# Altium schematic sheet Display-ST0103A2W-WSNLW-F.SchDoc
size B; SheetNumber: 14; SheetTotal: 15
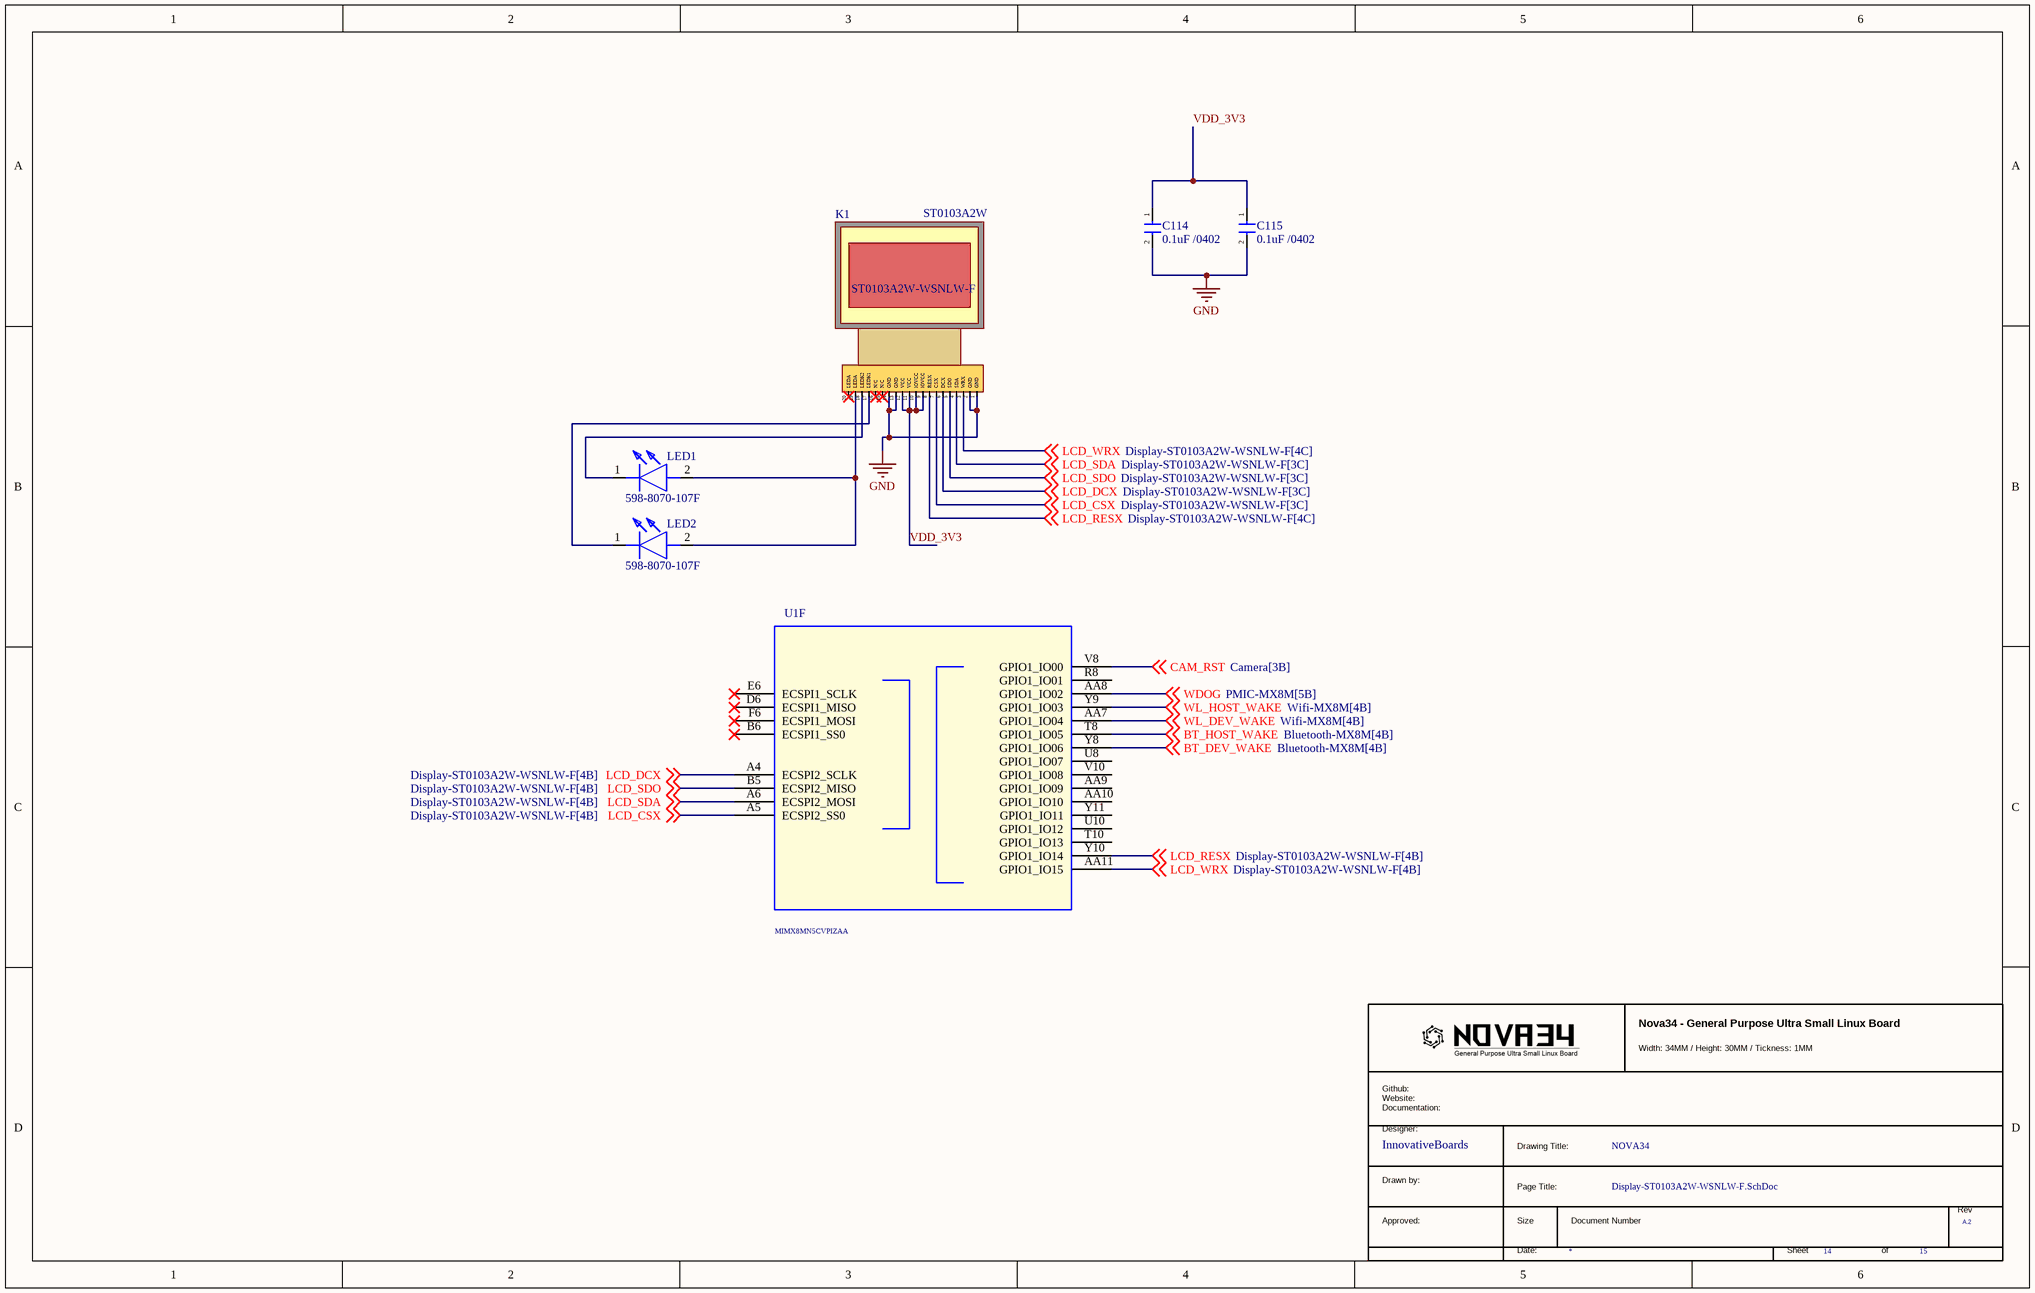
[diagram p0: Display-ST0103A2W-WSNLW-F.SchDoc]

## Parts
*  RevCode: A.2  (hidden comment: TitleBlock_MCPG)  (graphical)
C114  0.1uF /0402  [CAPC1005X70N]
C115  0.1uF /0402  [CAPC1005X70N]
K1  ST0103A2W  [Display]
LED1  598-8070-107F  [5988070107F]
LED2  598-8070-107F  [5988070107F]
U1  MIMX8MN5CVPIZAA  [BGA306C50P21X21_1100X1100X101]  (part F of 12)

## Nets
GND: C114.2 C115.2 K1.1(GND) K1.2(GND) K1.13(GND) K1.14(GND)
BT_DEV_WAKE: U1.Y8(GPIO1_IO06) ; off-sheet BT_DEV_WAKE
BT_HOST_WAKE: U1.T8(GPIO1_IO05) ; off-sheet BT_HOST_WAKE
CAM_RST: U1.V8(GPIO1_IO00) ; off-sheet CAM_RST
LCD_CSX: K1.7(CSX) U1.A5(ECSPI2_SS0) ; off-sheet LCD_CSX
LCD_DCX: K1.6(DCX) U1.A4(ECSPI2_SCLK) ; off-sheet LCD_DCX
LCD_RESX: K1.8(RESX) U1.Y10(GPIO1_IO14) ; off-sheet LCD_RESX
LCD_SDA: K1.4(SDA) U1.A6(ECSPI2_MOSI) ; off-sheet LCD_SDA
LCD_SDO: K1.5(SDO) U1.B5(ECSPI2_MISO) ; off-sheet LCD_SDO
LCD_WRX: K1.3(WRX) U1.AA11(GPIO1_IO15) ; off-sheet LCD_WRX
VDD_3V3: C114.1 C115.1 K1.9(lOVCC) K1.10(lOVCC) K1.11(VCC) K1.12(VCC)
WDOG: U1.AA8(GPIO1_IO02) ; off-sheet WDOG
WL_DEV_WAKE: U1.AA7(GPIO1_IO04) ; off-sheet WL_DEV_WAKE
WL_HOST_WAKE: U1.Y9(GPIO1_IO03) ; off-sheet WL_HOST_WAKE
NetK1_17: K1.17(LEDK1) LED2.1(K)
NetK1_18: K1.18(LEDK2) LED1.1(K)
NetK1_19: K1.19(LEDA) LED1.2(A) LED2.2(A)

Not connected (* = marked no-connect by the designer): K1 15(N/C)* 16(N/C)* 20(LEDA)*; U1 AA9(GPIO1_IO09) AA10(GPIO1_IO10) B6(ECSPI1_SS0)* D6(ECSPI1_MISO)* E6(ECSPI1_SCLK)* F6(ECSPI1_MOSI)* R8(GPIO1_IO01) T10(GPIO1_IO13) U8(GPIO1_IO07) U10(GPIO1_IO12) V10(GPIO1_IO08) Y11(GPIO1_IO11)

## Notes on the sheet
- (in symbol ST0103A2W) ST0103A2W-WSNLW-F
- (in symbol TitleBlock_MCPG) Nova34 - General Purpose Ultra Small Linux Board; Width: 34MM / Height: 30MM / Tickness: 1MM; Github: / Website: / Documentation:; Designer:; InnovativeBoards; Drawing Title:; NOVA34; Drawn by:; Page Title:; Rev; Approved:; Size; Document Number; Date:; Sheet; of

## Library data of the parts
C114 C115 = GRM155R71C104KA88D: Capacitor; Manufacturer_Name: Murata Electronics; Datasheet Link: https://search.murata.co.jp/Ceramy/image/img/A01X/G101/ENG/GRM155R71C104KA88-01A.pdf; Height: 0.7mm; Manufacturer_Part_Number: GRM155R71C104KA88D; Mouser Part Number: N/A; Arrow Part Number: GRM155R71C104KA88D; Arrow Price/Stock: https://www.arrow.com/en/products/grm155r71c104ka88d/murata-manufacturing?utm_currency=USD&region=nac
LED1 LED2 = 598-8070-107F: LED; Manufacturer_Name: Dialight; Datasheet Link: https://www.mouser.in/datasheet/2/109/Dialight_CBI_data_598_0603_Apr2018-2944350.pdf; Height: 0.8mm; Manufacturer_Part_Number: 598-8070-107F; Mouser Part Number: 645-598-8070-107F; Mouser Price/Stock: https://www.mouser.co.uk/ProductDetail/Dialight/598-8070-107F?qs=7JStj%2FjQ2SEP6f6GzqcocA%3D%3D; Arrow Part Number: 598-8070-107F; Arrow Price/Stock: https://www.arrow.com/en/products/598-8070-107f/dialight?region=nac
U1 = MIMX8MN: IC CPU QUAD CORTEX A53+M7 1.4GHZ -- BGA306; PCB Footprint: pbga306_0p5_sq11mm; AGILE_PN: TMP-CIP-5098; CAD_APPROVED: Yes; PRE_APN: 330-77152; Temp Range: -40¡ãC to 105¡ãC; MFG_NAME01: NXP SEMICONDUCTORS; CLASS: IC; HEIGHT: 1.01MM; ROHS: Yes; MFG_PN01: MIMX8MN5CVPIZAA
* = TitleBlock_MCPG: Page Create Date: March  8, 1995